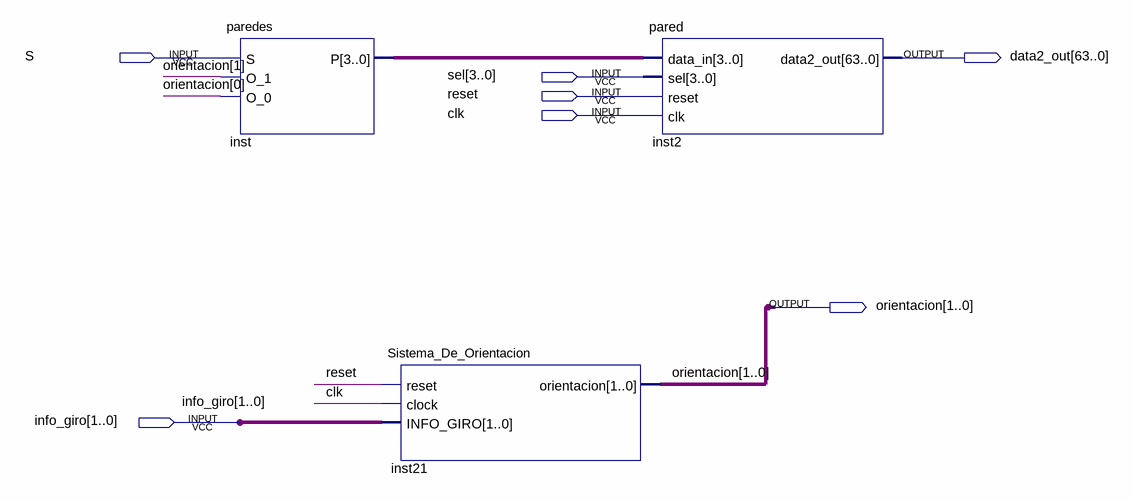
[diagram p0: schematic sheet]
// Quartus schematic pruebaparedes.bdf as structural Verilog: 3 symbols, 7 pins
module pruebaparedes (
  input  S,
  input  [3:0] sel,
  input  reset,
  input  clk,
  input  [1:0] info_giro,
  output [63:0] data2_out,
  output [1:0] orientacion
);

  wire [3:0] inst_p;

  paredes inst (.S(S), .O_1(orientacion[1]), .O_0(orientacion[0]), .P(inst_p));
  Sistema_De_Orientacion inst21 (.reset(reset), .clock(clk), .INFO_GIRO(info_giro), .orientacion(orientacion));
  pared inst2 (.data_in(inst_p), .sel(sel), .reset(reset), .clk(clk), .data2_out(data2_out));
endmodule
